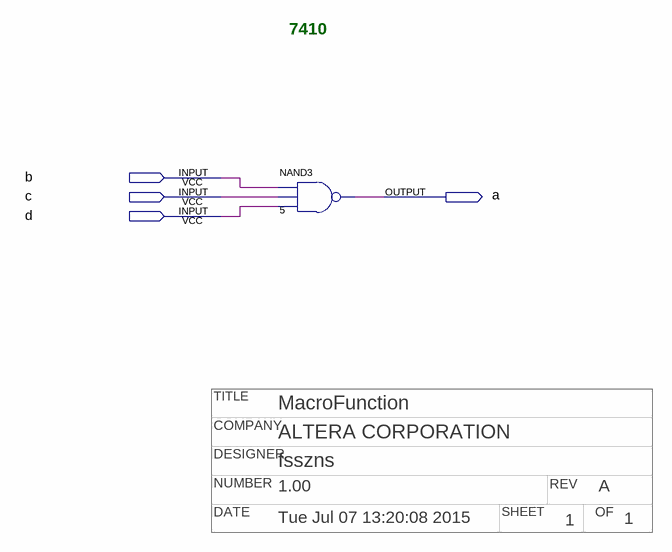
[diagram p0: schematic sheet]
// Quartus schematic a7410.bdf as structural Verilog: 1 symbols, 4 pins
// Title block: TITLE: MacroFunction; COMPANY: ALTERA CORPORATION; DESIGNER: fsszns; NUMBER: 1.00; REV: A; DATE: Tue Jul 07 13:20:08 2015; SHEET: 1; OF: 1
module a7410 (
  input  b,
  input  c,
  input  d,
  output a
);

  nand u_5 (a, b, c, d);

  // Notes on the sheet:
  //   7410
endmodule
